# Altium schematic sheet CPU.SchDoc
size A3; SheetNumber: 1; SheetTotal: 4
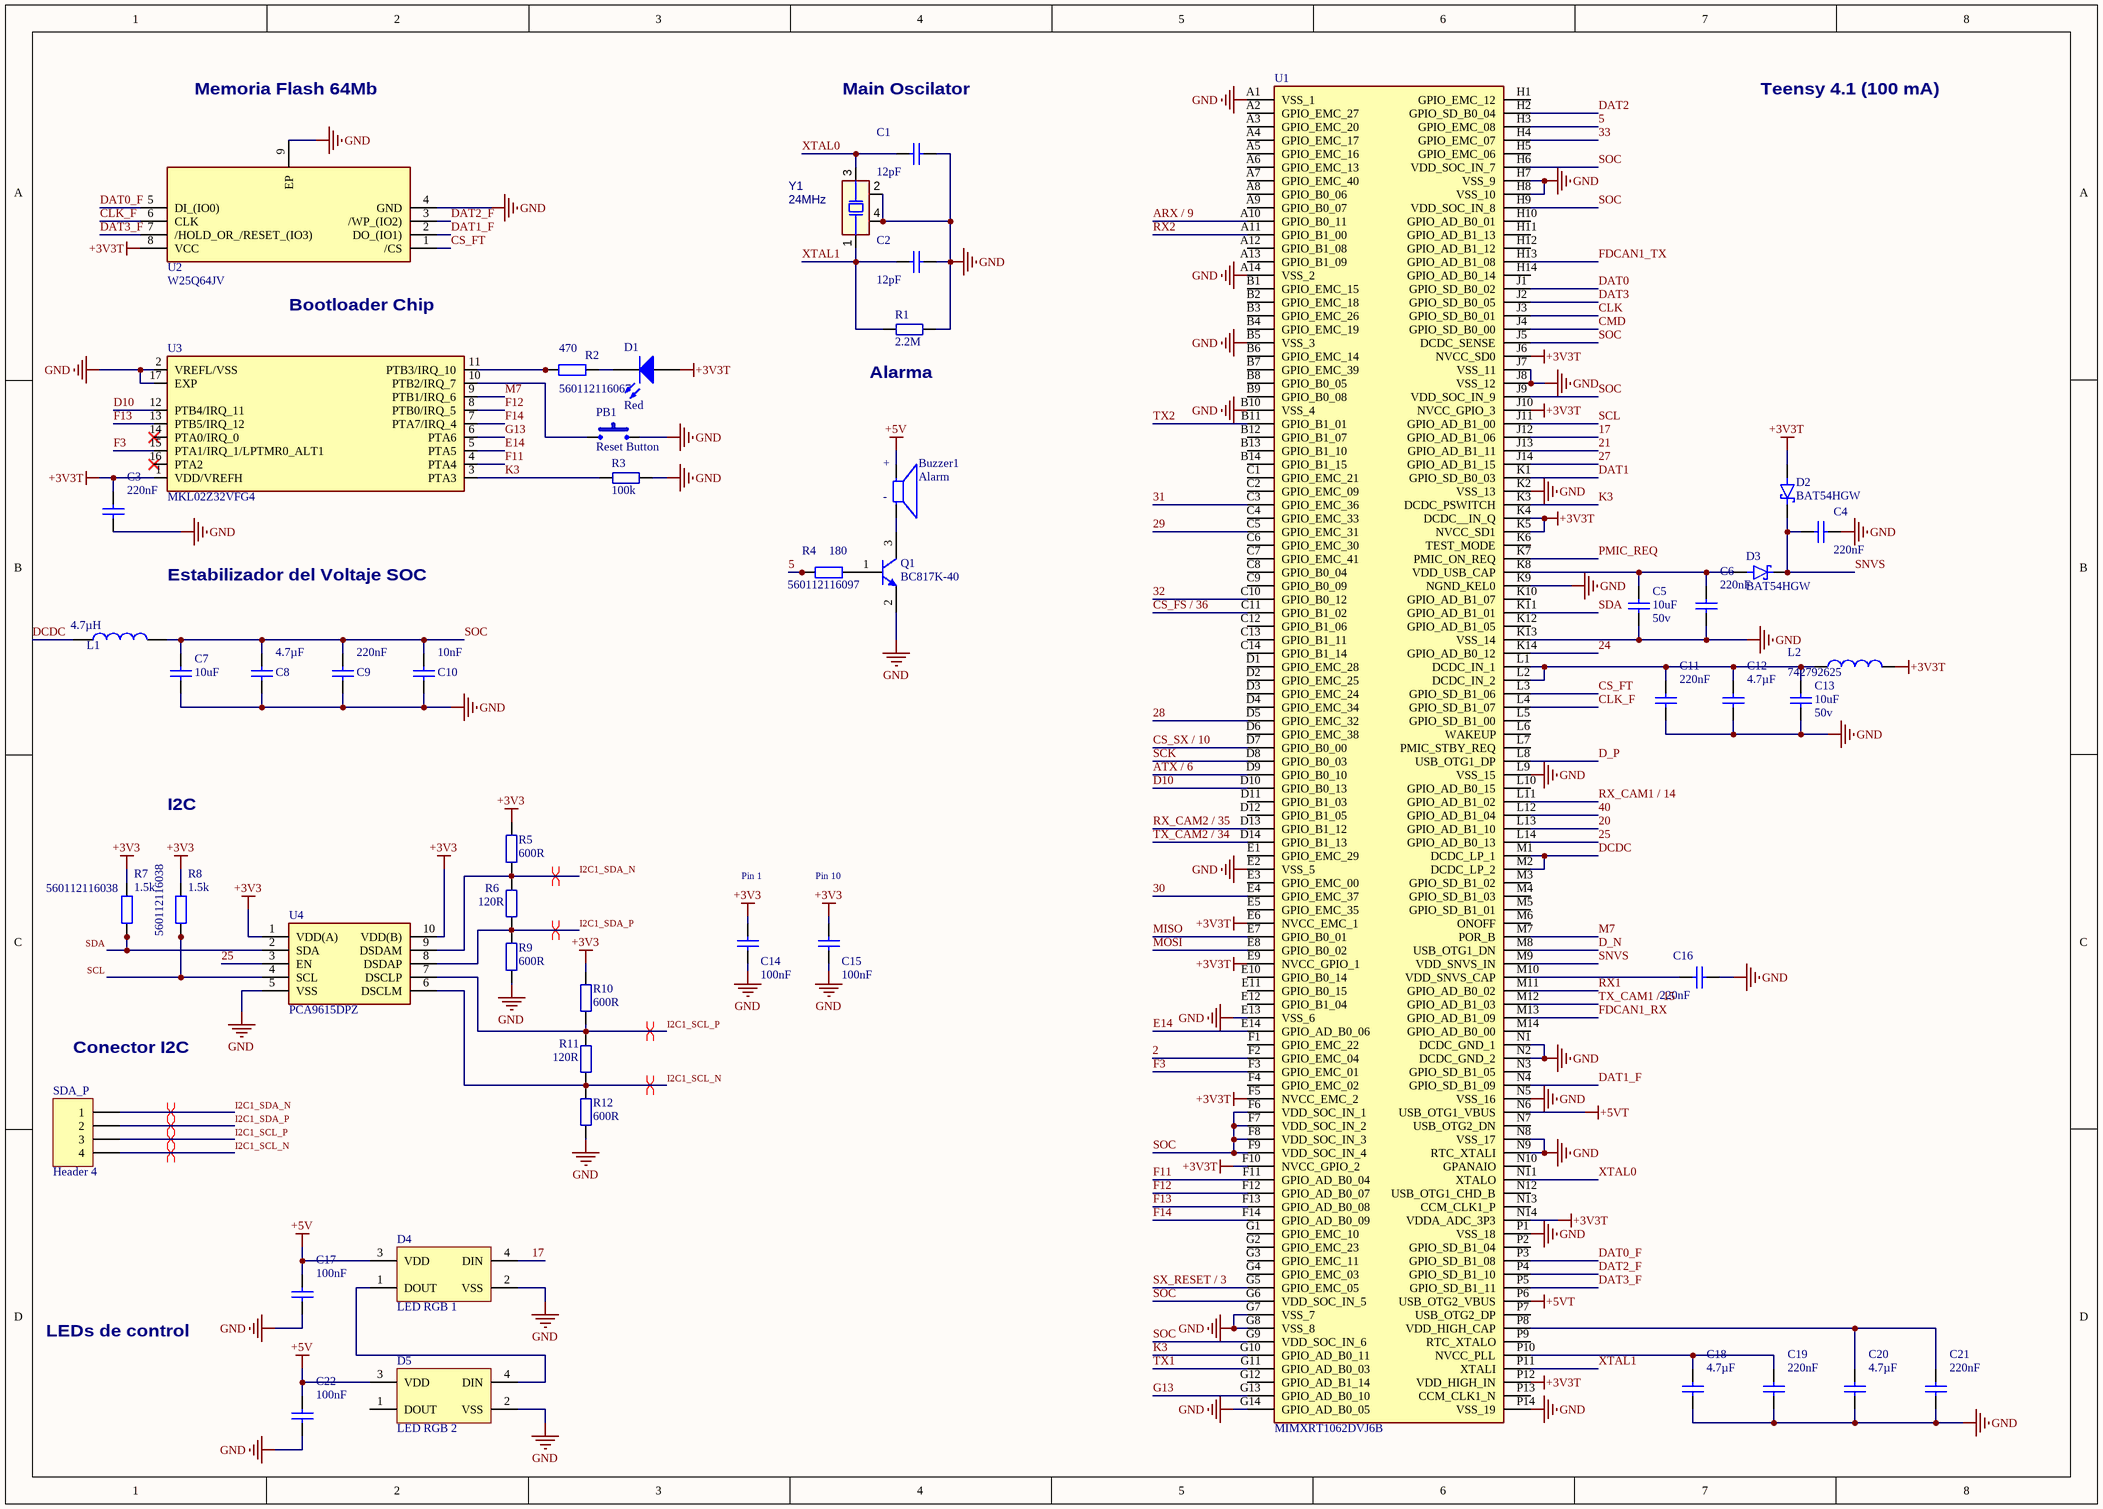
[diagram p0: CPU.SchDoc]

## Parts
Buzzer1  Alarm  [CMT-8504-100-SMT-TR-Footprint-1]
C1  value 12pF  [WCAP-CSRF_0402]  (hidden comment: 885392005127)
C2  value 12pF  [WCAP-CSRF_0402]  (hidden comment: 885392005127)
C3  value 220nF  [WCAP-CSGP_0603_L1.6W0.8H0.8_Reflow]  (hidden comment: 885012206073)
C4  value 220nF  [WCAP-CSGP_0603_L1.6W0.8H0.8_Reflow]  (hidden comment: 885012206073)
C5  value 10uF  Volte: 50v  [MY_0603]  (hidden comment: Cap ceramic)
C6  value 220nF  [WCAP-CSGP_0603_L1.6W0.8H0.8_Reflow]  (hidden comment: 885012206073)
C7  value 10uF  [MY_0603]  (hidden comment: Cap ceramic)
C8  value 4.7µF  [WCAP-CSGP_0603_L1.6W0.8H0.8_Reflow]  (hidden comment: 885012106012)
C9  value 220nF  [WCAP-CSGP_0603_L1.6W0.8H0.8_Reflow]  (hidden comment: 885012206073)
C10  value 10nF  [WCAP-CSGP_0603_L1.6W0.8H0.8_Reflow]  (hidden comment: 885012206065)
C11  value 220nF  [WCAP-CSGP_0603_L1.6W0.8H0.8_Reflow]  (hidden comment: 885012206073)
C12  value 4.7µF  [WCAP-CSGP_0603_L1.6W0.8H0.8_Reflow]  (hidden comment: 885012106012)
C13  value 10uF  Volte: 50v  [MY_0603]  (hidden comment: Cap ceramic)
C14  value 100nF  [WCAP-CSGP_0603_L1.6W0.8H0.8_Reflow]  (hidden comment: 885012206071)
C15  value 100nF  [WCAP-CSGP_0603_L1.6W0.8H0.8_Reflow]  (hidden comment: 885012206071)
C16  value 220nF  [WCAP-CSGP_0603_L1.6W0.8H0.8_Reflow]  (hidden comment: 885012206073)
C17  value 100nF  [WCAP-CSGP_0603_L1.6W0.8H0.8_Reflow]  (hidden comment: 885012206071)
C18  value 4.7µF  [WCAP-CSGP_0603_L1.6W0.8H0.8_Reflow]  (hidden comment: 885012106012)
C19  value 220nF  [WCAP-CSGP_0603_L1.6W0.8H0.8_Reflow]  (hidden comment: 885012206073)
C20  value 4.7µF  [WCAP-CSGP_0603_L1.6W0.8H0.8_Reflow]  (hidden comment: 885012106012)
C21  value 220nF  [WCAP-CSGP_0603_L1.6W0.8H0.8_Reflow]  (hidden comment: 885012206073)
C22  value 100nF  [WCAP-CSGP_0603_L1.6W0.8H0.8_Reflow]  (hidden comment: 885012206071)
D1  Red  [MY_LED_0805]
D2  BAT54HGW  [BAT54HGW-Footprint-1]
D3  BAT54HGW  [BAT54HGW-Footprint-1]
D4  LED RGB 1  [1313210530000]
D5  LED RGB 2  [1313210530000]
L1  Inductance: 4.7µH  [WE-PMI_0805_L2W1.2H1]  (hidden comment: 74479775247)
L2  742792625  [WE-CBF_0603_L1.6W0.8H0.8_HC]
PB1  Reset Button  [Push Button-Footprint-1]
Q1  BC817K-40  [INF-SOT23_N]
R1  2.2M  [R0603-0.45]
R2  560112116067  value 470  [WRIS-RSKS_0603_Reflow]
R3  100k  [R0603-0.45]
R4  560112116097  value 180  [WRIS-RSKS_0603_Reflow]
R5  600R  [R0603-0.45]
R6  120R  [R0603-0.45]
R7  560112116038  value 1.5k  [WRIS-RSKS_0603_Reflow]
R8  560112116038  value 1.5k  [WRIS-RSKS_0603_Reflow]
R9  600R  [R0603-0.45]
R10  600R  [R0603-0.45]
R11  120R  [R0603-0.45]
R12  600R  [R0603-0.45]
SDA_P  Header 4  [JST XH]
U1  MIMXRT1062DVJ6B  [BGA196C80P14X14_1200X1200X152]
U2  W25Q64JV  [WSON 8X6]
U3  MKL02Z32VFG4  [QFN50P300X300X65-17N]
U4  PCA9615DPZ  [PCA9615DPZ-Footprint-1]
Y1  24MHz  [EPSON-FA-128_V]

## Nets
+3V3: C14.2 C15.2 R5.1 R7.1 R8.1 R10.1 U4.1(VDD(A)) U4.10(VDD(B))
+3V3T: C3.1 D1.A D2.A L2.2 U1.E6(NVCC_EMC_1) U1.E9(NVCC_GPIO_1) U1.F5(NVCC_EMC_2) U1.F10(NVCC_GPIO_2) U1.J6(NVCC_SD0) U1.J10(NVCC_GPIO_3) U1.K4(DCDC__IN_Q) U1.K5(NVCC_SD1) U1.N14(VDDA_ADC_3P3) U1.P12(VDD_HIGH_IN) U2.8(VCC) U3.1(VDD/VREFH)
+5V: Buzzer1.P C17.1 C22.1 D4.3(VDD) D5.3(VDD)
+5VT: U1.N6(USB_OTG1_VBUS) U1.P6(USB_OTG2_VBUS)
GND: C1.2 C2.2 C3.2 C4.1 C5.2 C6.2 C7.2 C8.2 C9.2 C10.2 C11.2 C12.2 C13.2 C14.1 C15.1 C16.2 C17.2 C18.2 C19.2 C20.2 C21.2 C22.2 D4.2(VSS) D5.2(VSS) PB1.2 Q1.2(E) R1.2 R3.2 R9.2 R12.2 U1.A1(VSS_1) U1.A14(VSS_2) U1.B5(VSS_3) U1.B10(VSS_4) U1.E2(VSS_5) U1.E13(VSS_6) U1.G7(VSS_7) U1.G8(VSS_8) U1.G14(GPIO_AD_B0_05) U1.H7(VSS_9) U1.H8(VSS_10) U1.J7(VSS_11) U1.J8(VSS_12) U1.K2(VSS_13) U1.K9(NGND_KEL0) U1.K13(VSS_14) U1.L9(VSS_15) U1.N1(DCDC_GND_1) U1.N2(DCDC_GND_2) U1.N5(VSS_16) U1.N8(VSS_17) U1.N9(RTC_XTALI) U1.P1(VSS_18) U1.P14(VSS_19) U2.4(GND) U2.9(EP) U3.2(VREFL/VSS) U3.17(EXP) U4.5(VSS) Y1.2(NC) Y1.4(NC)
2: U1.F2(GPIO_EMC_04)
5: R4.1 U1.H3(GPIO_EMC_08)
17: D4.4(DIN) U1.J12(GPIO_AD_B1_06)
20: U1.L13(GPIO_AD_B1_10)
21: U1.J13(GPIO_AD_B1_11)
24: U1.K14(GPIO_AD_B0_12)
25: U1.L14(GPIO_AD_B0_13) U4.3(EN)
27: U1.J14(GPIO_AD_B1_15)
28: U1.D5(GPIO_EMC_32)
29: U1.C5(GPIO_EMC_31)
30: U1.E4(GPIO_EMC_37)
31: U1.C3(GPIO_EMC_36)
32: U1.C10(GPIO_B0_12)
33: U1.H4(GPIO_EMC_07)
40: U1.L12(GPIO_AD_B1_04)
ARX / 9: U1.A10(GPIO_B0_11)
ATX / 6: U1.D9(GPIO_B0_10)
CLK: U1.J3(GPIO_SD_B0_01)
CLK_F: U1.L4(GPIO_SD_B1_07) U2.6(CLK)
CMD: U1.J4(GPIO_SD_B0_00)
CS_FS / 36: U1.C11(GPIO_B1_02)
CS_FT: U1.L3(GPIO_SD_B1_06) U2.1(/CS)
CS_SX / 10: U1.D7(GPIO_B0_00)
D10: U1.D10(GPIO_B0_13) U3.12(PTB4/IRQ_11)
D_N: U1.M8(USB_OTG1_DN)
D_P: U1.L8(USB_OTG1_DP)
DAT0: U1.J1(GPIO_SD_B0_02)
DAT0_F: U1.P3(GPIO_SD_B1_08) U2.5(DI_(IO0))
DAT1: U1.K1(GPIO_SD_B0_03)
DAT1_F: U1.N4(GPIO_SD_B1_09) U2.2(DO_(IO1))
DAT2: U1.H2(GPIO_SD_B0_04)
DAT2_F: U1.P4(GPIO_SD_B1_10) U2.3(/WP_(IO2))
DAT3: U1.J2(GPIO_SD_B0_05)
DAT3_F: U1.P5(GPIO_SD_B1_11) U2.7(/HOLD_OR_/RESET_(IO3))
DCDC: L1.1 U1.M1(DCDC_LP_1) U1.M2(DCDC_LP_2)
E14: U1.E14(GPIO_AD_B0_06) U3.5(PTA5)
F3: U1.F3(GPIO_EMC_01) U3.15(PTA1/IRQ_1/LPTMR0_ALT1)
F11: U1.F11(GPIO_AD_B0_04) U3.4(PTA4)
F12: U1.F12(GPIO_AD_B0_07) U3.8(PTB0/IRQ_5)
F13: U1.F13(GPIO_AD_B0_08) U3.13(PTB5/IRQ_12)
F14: U1.F14(GPIO_AD_B0_09) U3.7(PTA7/IRQ_4)
FDCAN1_RX: U1.M13(GPIO_AD_B1_09)
FDCAN1_TX: U1.H13(GPIO_AD_B1_08)
G13: U1.G13(GPIO_AD_B0_10) U3.6(PTA6)
I2C1_SCL_N: R11.1 R12.1 SDA_P.4 U4.6(DSCLM)
I2C1_SCL_P: R10.2 R11.2 SDA_P.3 U4.7(DSCLP)
I2C1_SDA_N: R5.2 R6.2 SDA_P.1 U4.9(DSDAM)
I2C1_SDA_P: R6.1 R9.1 SDA_P.2 U4.8(DSDAP)
K3: R3.1 U1.G10(GPIO_AD_B0_11) U1.K3(DCDC_PSWITCH) U3.3(PTA3)
M7: U1.M7(POR_B) U3.9(PTB1/IRQ_6)
MISO: U1.E7(GPIO_B0_01)
MOSI: U1.E8(GPIO_B0_02)
PMIC_REQ: U1.K7(PMIC_ON_REQ)
RX1: U1.M11(GPIO_AD_B0_02)
RX2: U1.A11(GPIO_B1_00)
RX_CAM1 / 14: U1.L11(GPIO_AD_B1_02)
RX_CAM2 / 35: U1.D13(GPIO_B1_12)
SCK: U1.D8(GPIO_B0_03)
SCL: R8.2 U1.J11(GPIO_AD_B1_00) U4.4(SCL)
SDA: R7.2 U1.K11(GPIO_AD_B1_01) U4.2(SDA)
SNVS: C4.2 D2.C(K) D3.C(K) U1.M9(VDD_SNVS_IN)
SOC: C7.1 C8.1 C9.1 C10.1 L1.2 U1.F6(VDD_SOC_IN_1) U1.F7(VDD_SOC_IN_2) U1.F8(VDD_SOC_IN_3) U1.F9(VDD_SOC_IN_4) U1.G6(VDD_SOC_IN_5) U1.G9(VDD_SOC_IN_6) U1.H6(VDD_SOC_IN_7) U1.H9(VDD_SOC_IN_8) U1.J5(DCDC_SENSE) U1.J9(VDD_SOC_IN_9)
SX_RESET / 3: U1.G5(GPIO_EMC_05)
TX1: U1.G11(GPIO_AD_B0_03)
TX2: U1.B11(GPIO_B1_01)
TX_CAM1 / 15: U1.M12(GPIO_AD_B1_03)
TX_CAM2 / 34: U1.D14(GPIO_B1_13)
XTAL0: C1.1 U1.N11(XTALO) Y1.3(X2)
XTAL1: C2.1 R1.1 U1.P11(XTALI) Y1.1(X1)
NetBuzzer1_N: Buzzer1.N Q1.3(C)
NetC5_1: C5.1 C6.1 D3.A U1.K8(VDD_USB_CAP)
NetC11_1: C11.1 C12.1 C13.1 L2.1 U1.L1(DCDC_IN_1) U1.L2(DCDC_IN_2)
NetC16_1: C16.1 U1.M10(VDD_SNVS_CAP)
NetC18_1: C18.1 C19.1 U1.P10(NVCC_PLL)
NetC20_1: C20.1 C21.1 U1.P8(VDD_HIGH_CAP)
NetD1_K: D1.K R2.1
NetD4_1: D4.1(DOUT) D5.4(DIN)
NetPB1_1: PB1.1 U3.10(PTB2/IRQ_7)
NetQ1_1: Q1.1(B) R4.2
NetR2_2: R2.2 U3.11(PTB3/IRQ_10)

Not connected (* = marked no-connect by the designer): D5 1(DOUT); U1 A2(GPIO_EMC_27) A3(GPIO_EMC_20) A4(GPIO_EMC_17) A5(GPIO_EMC_16) A6(GPIO_EMC_13) A7(GPIO_EMC_40) A8(GPIO_B0_06) A9(GPIO_B0_07) A12(GPIO_B1_08) A13(GPIO_B1_09) B1(GPIO_EMC_15) B2(GPIO_EMC_18) B3(GPIO_EMC_26) B4(GPIO_EMC_19) B6(GPIO_EMC_14) B7(GPIO_EMC_39) B8(GPIO_B0_05) B9(GPIO_B0_08) B12(GPIO_B1_07) B13(GPIO_B1_10) B14(GPIO_B1_15) C1(GPIO_EMC_21) C2(GPIO_EMC_09) C4(GPIO_EMC_33) C6(GPIO_EMC_30) C7(GPIO_EMC_41) C8(GPIO_B0_04) C9(GPIO_B0_09) C12(GPIO_B1_06) C13(GPIO_B1_11) C14(GPIO_B1_14) D1(GPIO_EMC_28) D2(GPIO_EMC_25) D3(GPIO_EMC_24) D4(GPIO_EMC_34) D6(GPIO_EMC_38) D11(GPIO_B1_03) D12(GPIO_B1_05) E1(GPIO_EMC_29) E3(GPIO_EMC_00) E5(GPIO_EMC_35) E10(GPIO_B0_14) E11(GPIO_B0_15) E12(GPIO_B1_04) F1(GPIO_EMC_22) F4(GPIO_EMC_02) G1(GPIO_EMC_10) G2(GPIO_EMC_23) G3(GPIO_EMC_11) G4(GPIO_EMC_03) G12(GPIO_AD_B1_14) H1(GPIO_EMC_12) H5(GPIO_EMC_06) H10(GPIO_AD_B0_01) H11(GPIO_AD_B1_13) H12(GPIO_AD_B1_12) H14(GPIO_AD_B0_14) K6(TEST_MODE) K10(GPIO_AD_B1_07) K12(GPIO_AD_B1_05) L5(GPIO_SD_B1_00) L6(WAKEUP) L7(PMIC_STBY_REQ) L10(GPIO_AD_B0_15) M3(GPIO_SD_B1_02) M4(GPIO_SD_B1_03) M5(GPIO_SD_B1_01) M6(ONOFF) M14(GPIO_AD_B0_00) N3(GPIO_SD_B1_05) N7(USB_OTG2_DN) N10(GPANAIO) N12(USB_OTG1_CHD_B) N13(CCM_CLK1_P) P2(GPIO_SD_B1_04) P7(USB_OTG2_DP) P9(RTC_XTALO) P13(CCM_CLK1_N); U3 14(PTA0/IRQ_0)* 16(PTA2)*

## Layout directives
differential pair: I2C1_SCL_N, I2C1_SCL_P, I2C1_SDA_N, I2C1_SDA_P

## Notes on the sheet
- Memoria Flash 64Mb
- Main Oscilator
- Teensy 4.1 (100 mA)
- Bootloader Chip
- (near R1) Alarma
- Estabilizador del Voltaje SOC
- I2C
- Pin 1
- Pin 10
- Conector I2C
- LEDs de control
- (in symbol CMP-00027-00000-2) +; -

## Library data of the parts
Buzzer1 = CMP-00027-00000-2
C1 C2 = CMP-001-01078-1: WCAP-CSRF Multilayer Ceramic Chip Capacitor High Frequency, size 0402, NP0 Class I, 12pF, 50VDC; Manufacturer: Wurth Elektronik; Rated Voltage (DC): 50V; Insulation Resistance: 10GOhm; Technical Reference: NP00402120G050DFCT1R000; Capacitance Tolerance: +/-2%; Q Factor: 640; Source: WCAP-CSRF.SchLib; Design Item ID: 885392005127; Component Type: Standard; Operating Temperature Max: 125°C; Pins: 2; ComponentLink1Description: Website Link; Operating Temperature Min: -55°C; Match Code: WCAP-CSRF; ComponentLink2Description: Datasheet Link; ComponentLink1URL: https://www.we-online.com/redexpert/article/885392005127?ad; Manufacturer Part Number: 885392005127; Ceramic Type: NP0 Class I; Category: Multilayer Ceramic Chip Capacitors; Height: 0.5mm; Mount: Surface Mount; Length: 1mm; Packaging: Tape and Reel; Width: 0.5mm; Case/Package: 0402; ComponentLink2URL: https://www.we-online.com/redexpert/spec/885392005127?ad
C3 C4 C6 C9 C11 C16 C19 C21 = CMP-001-00664-1: WCAP-CSGP Multilayer Ceramic Chip Capacitor, General Purpose, size 0603, X7R, 220nF, 25VDC; Manufacturer: Wurth Elektronik; Rated Voltage (DC): 25V; Insulation Resistance: 2.3GOhm; Capacitance Tolerance: +/-10%; Technical Reference: X7R0603224K025DFCT10000; Dissipation Factor: 3.5%; Source: WCAP-CSGP.SchLib; Design Item ID: 885012206073; Component Type: Standard; Pins: 2; Manufacturer Part Number: 885012206073; Case/Package: 0603; Mount: Surface Mount; Height: 0.8mm; ComponentLink2URL: https://www.we-online.com/redexpert/spec/885012206073?ad; ComponentLink1Description: Website Link; ComponentLink1URL: https://www.we-online.com/redexpert/article/885012206073?ad; ComponentLink2Description: Datasheet Link; Ceramic Type: X7R; Operating Temperature Min: -55°C; Category: Multilayer Ceramic Chip Capacitors; Packaging: Tape and Reel; Length: 1.6mm; Match Code: WCAP-CSGP; Operating Temperature Max: 125°C; Width: 0.8mm
C5 C7 C13 = CMP-015-000000-1: None polar capacitor; ASiD Part Number: C-AS; Source: PCB_Project1.SCHLIB; Pin Count: 2; Design Item ID: Cap ceramic; Component Type: Standard
C8 C12 C18 C20 = CMP-001-00440-1: WCAP-CSGP Multilayer Ceramic Chip Capacitor, General Purpose, size 0603, X5R, 4.7uF, 10VDC; Manufacturer: Wurth Elektronik; Rated Voltage (DC): 10V; Technical Reference: X5R0603475M010DFCT10000; Dissipation Factor: 10%; Insulation Resistance: 0.02GOhm; Capacitance Tolerance: +/-20%; Source: WCAP-CSGP.SchLib; Design Item ID: 885012106012; Component Type: Standard; ComponentLink2URL: https://www.we-online.com/redexpert/spec/885012106012?ad; Height: 0.8mm; Packaging: Tape and Reel; Case/Package: 0603; Manufacturer Part Number: 885012106012; Width: 0.8mm; Match Code: WCAP-CSGP; Mount: Surface Mount; Ceramic Type: X5R; Operating Temperature Max: 85°C; ComponentLink1Description: Website Link; Length: 1.6mm; ComponentLink1URL: https://www.we-online.com/redexpert/article/885012106012?ad; ComponentLink2Description: Datasheet Link; Category: Multilayer Ceramic Chip Capacitors; Operating Temperature Min: -55°C; Pins: 2
C10 = CMP-001-00655-1: WCAP-CSGP Multilayer Ceramic Chip Capacitor, General Purpose, size 0603, X7R, 10nF, 25VDC; Manufacturer: Wurth Elektronik; Dissipation Factor: 3.5%; Technical Reference: X7R0603103K025DFCT10000; Capacitance Tolerance: +/-10%; Insulation Resistance: 10GOhm; Rated Voltage (DC): 25V; Source: WCAP-CSGP.SchLib; Design Item ID: 885012206065; Component Type: Standard; ComponentLink1Description: Website Link; Packaging: Tape and Reel; Match Code: WCAP-CSGP; Ceramic Type: X7R; ComponentLink1URL: https://www.we-online.com/redexpert/article/885012206065?ad; ComponentLink2URL: https://www.we-online.com/redexpert/spec/885012206065?ad; Case/Package: 0603; Operating Temperature Min: -55°C; ComponentLink2Description: Datasheet Link; Category: Multilayer Ceramic Chip Capacitors; Pins: 2; Mount: Surface Mount; Height: 0.8mm; Length: 1.6mm; Operating Temperature Max: 125°C; Width: 0.8mm; Manufacturer Part Number: 885012206065
C14 C15 C17 C22 = CMP-001-00661-1: WCAP-CSGP Multilayer Ceramic Chip Capacitor, General Purpose, size 0603, X7R, 100nF, 25VDC; Manufacturer: Wurth Elektronik; Dissipation Factor: 3.5%; Capacitance Tolerance: +/-10%; Insulation Resistance: 5GOhm; Technical Reference: X7R0603104K025DFCT10000; Rated Voltage (DC): 25V; Source: WCAP-CSGP.SchLib; Design Item ID: 885012206071; Component Type: Standard; Manufacturer Part Number: 885012206071; Packaging: Tape and Reel; Height: 0.8mm; Mount: Surface Mount; Category: Multilayer Ceramic Chip Capacitors; Operating Temperature Min: -55°C; Case/Package: 0603; ComponentLink2Description: Datasheet Link; Width: 0.8mm; ComponentLink1URL: https://www.we-online.com/redexpert/article/885012206071?ad; Length: 1.6mm; Operating Temperature Max: 125°C; Match Code: WCAP-CSGP; ComponentLink2URL: https://www.we-online.com/redexpert/spec/885012206071?ad; ComponentLink1Description: Website Link; Pins: 2; Ceramic Type: X7R
D1 = LED: Typical INFRARED GaAs LED; ASiD Part Number: LED-AS
D2 D3 = CMP-100-000001-2: BAT54HGW Schotty Diode; Design Item ID: BAT54HGW; Pin Count: 2; Source: BAT54W.SchLib; Component Type: Standard
D4 D5 = CMP-004-00012-1: WL-ICLED Integrated Controller within LED, Side View 3210, 5.5mA; Manufacturer: Wurth Elektronik; Luminous Intensity (Green): 120mcd; Luminous Intensity (Blue): 50mcd; Emitting Color: Green & Red & Blue; Luminous Intensity (Red): 80mcd; Viewing Angle: 120°; Frequency of the PWM: 5kHz; Dominant Wavelength (Blue): 470nm; Peak Wavelength (Green): 520nm; Peak Wavelength (Blue): 465nm; Dominant Wavelength (Green): 525nm; Peak Wavelength (Red): 630nm; Dominant Wavelength (Red): 625nm; Width: 1.5mm; Source: WL-ICLED.SchLib; ComponentLink1URL: https://www.we-online.com/redexpert/article/1313210530000?ad; ComponentLink1Description: Website Link; Category: IC LEDs; Height: 1mm; ComponentLink2URL: https://www.we-online.com/redexpert/spec/1313210530000?ad; Match Code: WL-ICLED; Design Item ID: 1313210530000; ComponentLink2Description: Datasheet Link; IC Output Current: 5.5mA; Pins: 4; Case/Package: Side View 3210; Length: 3.2mm; Mount: Surface Mount; Operating Temperature Min: -40°C; Packaging: Tape and Reel; Operating Temperature Max: 85°C; Manufacturer Part Number: 1313210530000; Component Type: Standard
L1 = CMP-006-00205-1: WE-PMI SMT Power Multilayer Inductor, size 0805, 4.7µH, 0.85A, 312.5mO; Manufacturer: Wurth Elektronik; Q Factor: 25; Inductance Tolerance: 20%; Self Resonant Frequency: 30MHz; Saturation Current: 0.25A; Type: Low RDC; Design Item ID: 74479775247; Source: WE-PMI.SchLib; Component Type: Standard; Category: Shielded Power Inductors; Operating Temperature Min: -40°C; ComponentLink2URL: https://www.we-online.com/redexpert/spec/74479775247?ad; Height: 1mm; ComponentLink2Description: Datasheet Link; Length: 2mm; ComponentLink1URL: https://www.we-online.com/redexpert/article/74479775247?ad; Pins: 2; Match Code: WE-PMI; Mount: Surface Mount; DC Resistance: 312.5mO; Width: 1.2mm; Packaging: Tape and Reel; Operating Temperature Max: 125°C; Rated Current: 0.85A; ComponentLink1Description: Website Link; Manufacturer Part Number: 74479775247; Case/Package: 0805
L2 = CMP-006-00120-1: WE-CBF SMT EMI Suppression Ferrite Bead, size 0603, 120Ohm, 2A; Manufacturer: Wurth Elektronik; Impedance Max: 180Ohm; Type: High Current; Impedance Max Test Condition: 400MHz; DC Resistance Max: 0.05Ohm; Design Item ID: 742792625; Source: WE-CBF.SchLib; Component Type: Standard; Length: 1.6mm; Mount: Surface Mount; ComponentLink2Description: Datasheet Link; Match Code: WE-CBF; Height: 0.8mm; Pins: 2; Manufacturer Part Number: 742792625; ComponentLink1Description: Website Link; Packaging: Tape and Reel; Operating Temperature Max: 125°C; Operating Temperature Min: -55°C; Rated Current: 2A; ComponentLink1URL: https://www.we-online.com/redexpert/article/742792625?ad; Category: Ferrites for PCB Assembly; ComponentLink2URL: https://www.we-online.com/redexpert/spec/742792625?ad; Case/Package: 0603; Width: 0.8mm; Impedance @100MHz: 120Ohm
PB1 = CMP-010-000001-2: Push Button; Source: IFS_Altium.SchLib; Pin Count: 2; Component Type: Standard; Design Item ID: Push Button
Q1 = CMP-013-00004-1: Trans GP BJT NPN 45V 0.5A 500mW Automotive 3-Pin SOT-23 T/R; Pins: 3; RoHS Compliant: Yes; Max Operating Temperature: 150°C; Case/Package: SOT
R1 R3 = R: Resistor, generic
R2 = CMP-009-00390-1: WRIS-RSKS Thick Film Resistor, size 0603, 470Ohm, 100mW; Manufacturer: Wurth Elektronik; Limiting Element Voltage: 75V; Temperature Coefficient of Resistance Max: 100ppm/°C; Resistance Tolerance: +/-1%; Temperature Coefficient of Resistance Min: -100ppm/°C; Rated Power: 100mW; Height: 0.45mm; ComponentLink2Description: Datasheet Link; Component Type: Standard; ComponentLink1URL: https://www.we-online.com/redexpert/article/560112116067?ad; ComponentLink1Description: Website Link; Operating Temperature Min: -55°C; Match Code: WRIS-RSKS; Mount: Surface Mount; Case/Package: 0603; Source: WRIS-RSKS.SchLib; Length: 1.6mm; Category: Thick Film Resistors; Operating Temperature Max: 155°C; Pins: 2; Packaging: Tape and Reel; Manufacturer Part Number: 560112116067; ComponentLink2URL: https://www.we-online.com/redexpert/spec/560112116067?ad; Width: 0.8mm; Design Item ID: 560112116067
R4 = CMP-009-00420-1: WRIS-RSKS Thick Film Resistor, size 0603, 180Ohm, 100mW; Manufacturer: Wurth Elektronik; Temperature Coefficient of Resistance Max: 100ppm/°C; Limiting Element Voltage: 75V; Resistance Tolerance: +/-5%; Temperature Coefficient of Resistance Min: -100ppm/°C; Pins: 2; Design Item ID: 560112116097; Source: WRIS-RSKS.SchLib; Case/Package: 0603; Component Type: Standard; Height: 0.45mm; Operating Temperature Max: 155°C; ComponentLink1Description: Website Link; Category: Thick Film Resistors; Operating Temperature Min: -55°C; Packaging: Tape and Reel; Mount: Surface Mount; Manufacturer Part Number: 560112116097; Match Code: WRIS-RSKS; Length: 1.6mm; Rated Power: 100mW; ComponentLink2URL: https://www.we-online.com/redexpert/spec/560112116097?ad; ComponentLink1URL: https://www.we-online.com/redexpert/article/560112116097?ad; Width: 0.8mm; ComponentLink2Description: Datasheet Link
R5 R9 R10 R12 = CMP-009-000000-3: Resistor, 600R, 0805, 0.5W; Manufacturer: Vishay; Manufacturer Part Number: CRCW0805600RFKEAHP; Power Disipation: 0.5W
R6 = CMP-009-000000-3: Resistor, 120R, 0805, 0.5W; Manufacturer: Panasonic; Manufacturer Part Number: ERJ-P06F1200V; Power Disipation: 0.25W
R7 R8 = CMP-009-00361-1: WRIS-RSKS Thick Film Resistor, size 0603, 1500Ohm, 100mW; Manufacturer: Wurth Elektronik; Temperature Coefficient of Resistance Max: 100ppm/°C; Temperature Coefficient of Resistance Min: -100ppm/°C; Limiting Element Voltage: 75V; Resistance Tolerance: +/-1%; Component Type: Standard; Case/Package: 0603; Pins: 2; Design Item ID: 560112116038; Source: WRIS-RSKS.SchLib; Packaging: Tape and Reel; Operating Temperature Max: 155°C; Length: 1.6mm; ComponentLink2URL: https://www.we-online.com/redexpert/spec/560112116038?ad; ComponentLink1Description: Website Link; Operating Temperature Min: -55°C; Height: 0.45mm; Rated Power: 100mW; Match Code: WRIS-RSKS; Mount: Surface Mount; Category: Thick Film Resistors; Manufacturer Part Number: 560112116038; ComponentLink1URL: https://www.we-online.com/redexpert/article/560112116038?ad; Width: 0.8mm; ComponentLink2Description: Datasheet Link
R11 = CMP-009-000000-3: Resistor, generic; Manufacturer: Panasonic; Manufacturer Part Number: ERJ-P06F1200V; Power Disipation: 0.25W
SDA_P = CMP-016-000019-3: Header, 4-Pin; ASiD Part Number: Header 4-AS; Signal Integrity: Connector; Design Item ID: Header 4; Pin Count: 4; Component Type: Standard; Source: PCB_Project1.SCHLIB
U1 = CMP-072-000002-2: IC MCU 32BIT EXT MEM 196MAPBGA; Manufacturer_Name: NXP; Geometry.Height: 1.52mm; Source: MIMXRT1062DVJ6B.SchLib; Mouser Price/Stock: https://www.mouser.co.uk/ProductDetail/NXP-Semiconductors/MIMXRT1062DVJ6B?qs=BJlw7L4Cy7%252B08A9rbTO5WQ%3D%3D; Mouser Part Number: 771-MIMXRT1062DVJ6B; Datasheet Link: https://www.nxp.com/docs/en/nxp/data-sheets/IMXRT1060CEC.pdf; Arrow Part Number: MIMXRT1062DVJ6B; Manufacturer_Part_Number: MIMXRT1062DVJ6B; Design Item ID: MIMXRT1062DVJ6B; Arrow Price/Stock: https://www.arrow.com/en/products/mimxrt1062dvj6b/nxp-semiconductors?region=nac
U2 = CMP-078-000000-4: NOR Flash spiFlash, 64M-bit, DTR, 4Kb Uniform Sector; Manufacturer_Part_Number: W25Q64JVXGIM TR; Manufacturer_Name: Winbond; Geometry.Height: 0.5mm; Arrow Part Number: W25Q64JVXGIM TR; Datasheet Link: https://www.winbond.com/resource-files/w25q64jv_dtr%20revj%2003272018%20plus.pdf; Arrow Price/Stock: https://www.arrow.com/en/products/w25q64jvxgim-tr/winbond-electronics?region=nac; Source: W25Q64JVXGIM_TR.SchLib; Mouser Part Number: 454-W25Q64JVXGIMTR; Design Item ID: W25Q64JVXGIM_TR; Mouser Price/Stock: https://www.mouser.co.uk/ProductDetail/Winbond/W25Q64JVXGIM-TR?qs=qSfuJ%252Bfl%2Fd5DYf7S8uijYQ%3D%3D
U3 = CMP-068-000000-2: ARMÂ®CortexÂ®-M0+ Kinetis KL02å¾®æŽ§åˆ¶å™¨IC 32ä½48MHz 32KBï¼ˆ32K x 8ï¼‰é—ªå­˜16-QFNï¼ˆ3x3ï¼‰; MF: NXP USA; MP: MKL02Z32VFG4; Design Item ID: MKL02Z32VFG4; Component Type: Standard; Source: SnapEDAsch.SchLib; Pin Count: 17; Package: QFN-16 NXP Semiconductors; Value: *; SnapEDA_Link: https://www.snapeda.com/parts/MKL02Z32VFG4/NXP%20USA%20Inc./view-part/492537/?ref=snap; Availability: Unavailable; Price: None
U4 = CMP-00024-00001-1: 2 Channel  I2C-busbuffer; Manufacturer: NXP Semiconductors; Manufacturer Part Number: PCA9615DPZ
Y1 = CMP-003-00028-1: Crystal, 24 MHz, +/- 10 ppm, -20 to 75 degC, 4-Pin SMD, RoHS, Tape and Reel; Load Capacitance: 12pF; ESR: 80; Mounting Technology: SMT; Pins: 4; Case/Package: SMD/SMT; Frequency: 24MHz; Min Operating Temperature: -20°C; RoHS Compliant: Yes; Max Operating Temperature: 75°C